# Altium project pcb-uwt-788.PrjPcb
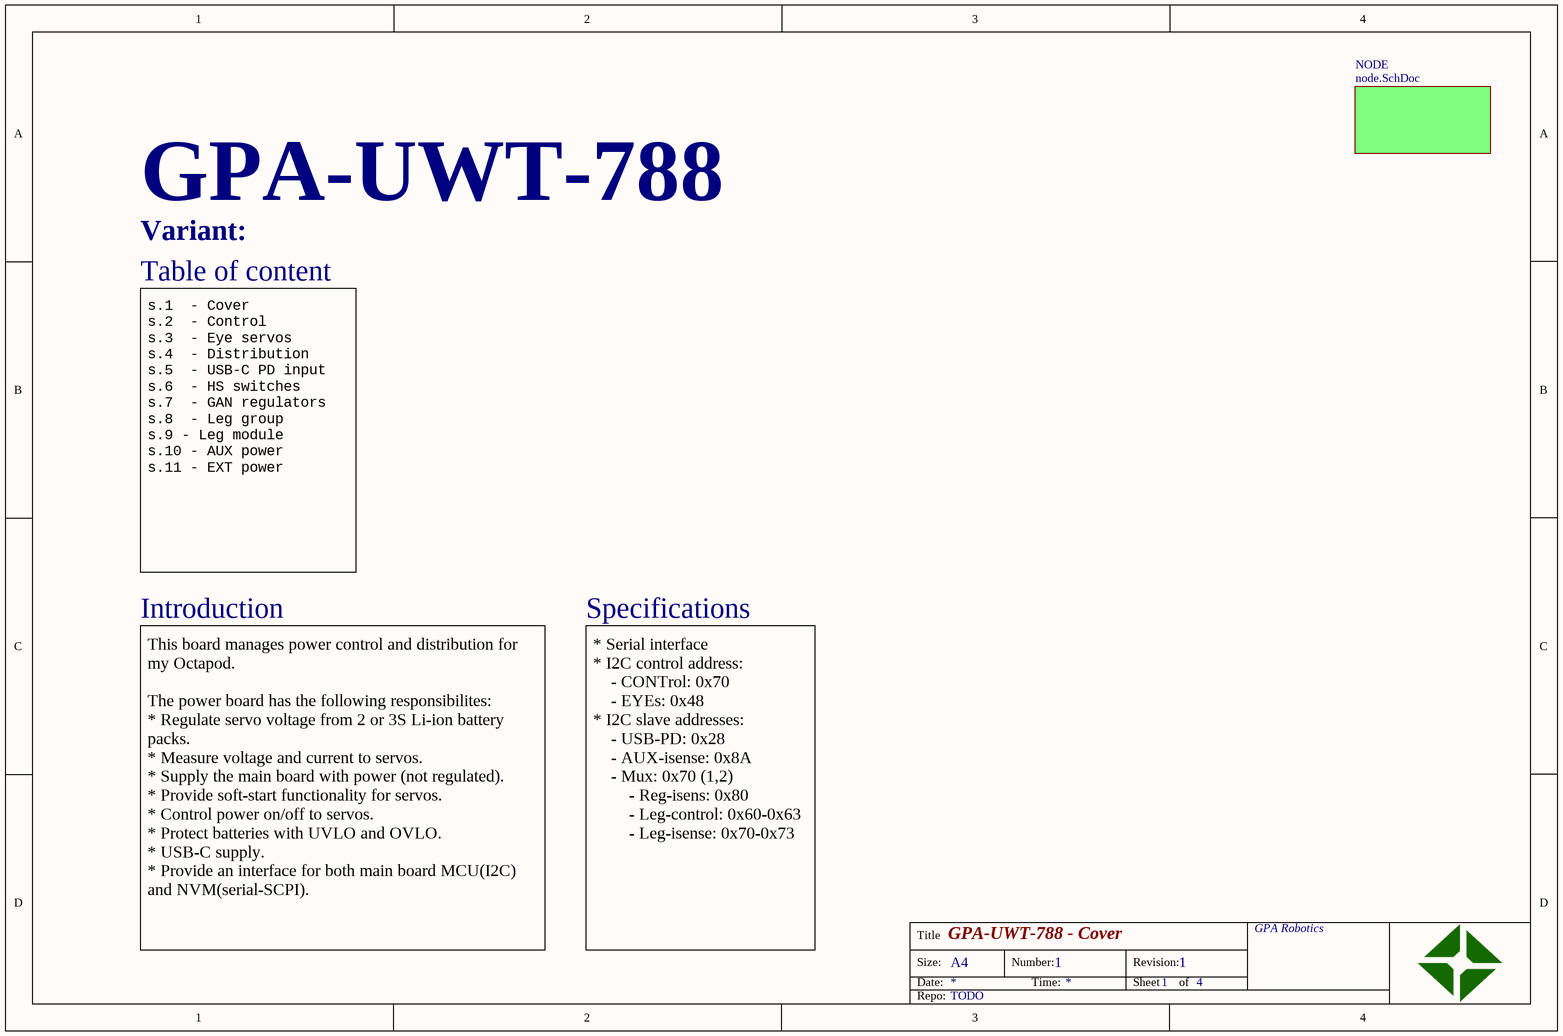
[diagram p0: cover.SchDoc]
project_author: Gustav Palmqvist; project_name: GPA-UWT-788; project_repo: TODO; project_revision: 1
4 sheets, 102 parts. Net scope: flat (ports and power ports of the same name join across sheets).
Board file: ioboard.PcbDoc
Sheets:
  cover.SchDoc
    NODE = node.SchDoc
      ETH_US = ethernet.SchDoc
      ETH_DS = ethernet.SchDoc
      POWER = powersupply.SchDoc

## Sheet cover.SchDoc: Cover
size A4; Organization: GPA Robotics; DocumentNumber: 1; SheetNumber: 1; SheetTotal: 4

### Sub-sheets
NODE = node.SchDoc: no entries

### Notes on the sheet
- Table of content
- s.1  - Cover
  s.2  - Control
  s.3  - Eye servos
  s.4  - Distribution
  s.5  - USB-C PD input
  s.6  - HS switches
  s.7  - GAN regulators
  s.8  - Leg group
  s.9 - Leg module
  s.10 - AUX power
  s.11 - EXT power
- Introduction
- Specifications
- This board manages power control and distribution for my Octapod.
  The power board has the following responsibilites:
  * Regulate servo voltage from 2 or 3S Li-ion battery packs.
  * Measure voltage and current to servos.
  * Supply the main board with power (not regulated).
  * Provide soft-start functionality for servos.
  * Control power on/off to servos.
  * Protect batteries with UVLO and OVLO.
  * USB-C supply.
  * Provide an interface for both main board MCU(I2C) and NVM(serial-SCPI).
- * Serial interface
  * I2C control address:
  - CONTrol: 0x70
  - EYEs: 0x48
  * I2C slave addresses:
  - USB-PD: 0x28
  - AUX-isense: 0x8A
  - Mux: 0x70 (1,2)
  - Reg-isens: 0x80
  - Leg-control: 0x60-0x63
  - Leg-isense: 0x70-0x73
- Variant:
- Title
- Size:
- Date:
- A4
- Number:
- Time:
- Revision:
- Sheet
- of
- Repo:

## Sheet node.SchDoc: Node
size A4; Organization: GPA Robotics; DocumentNumber: 2; Revision: REV 0; SheetNumber: 2; SheetTotal: 4
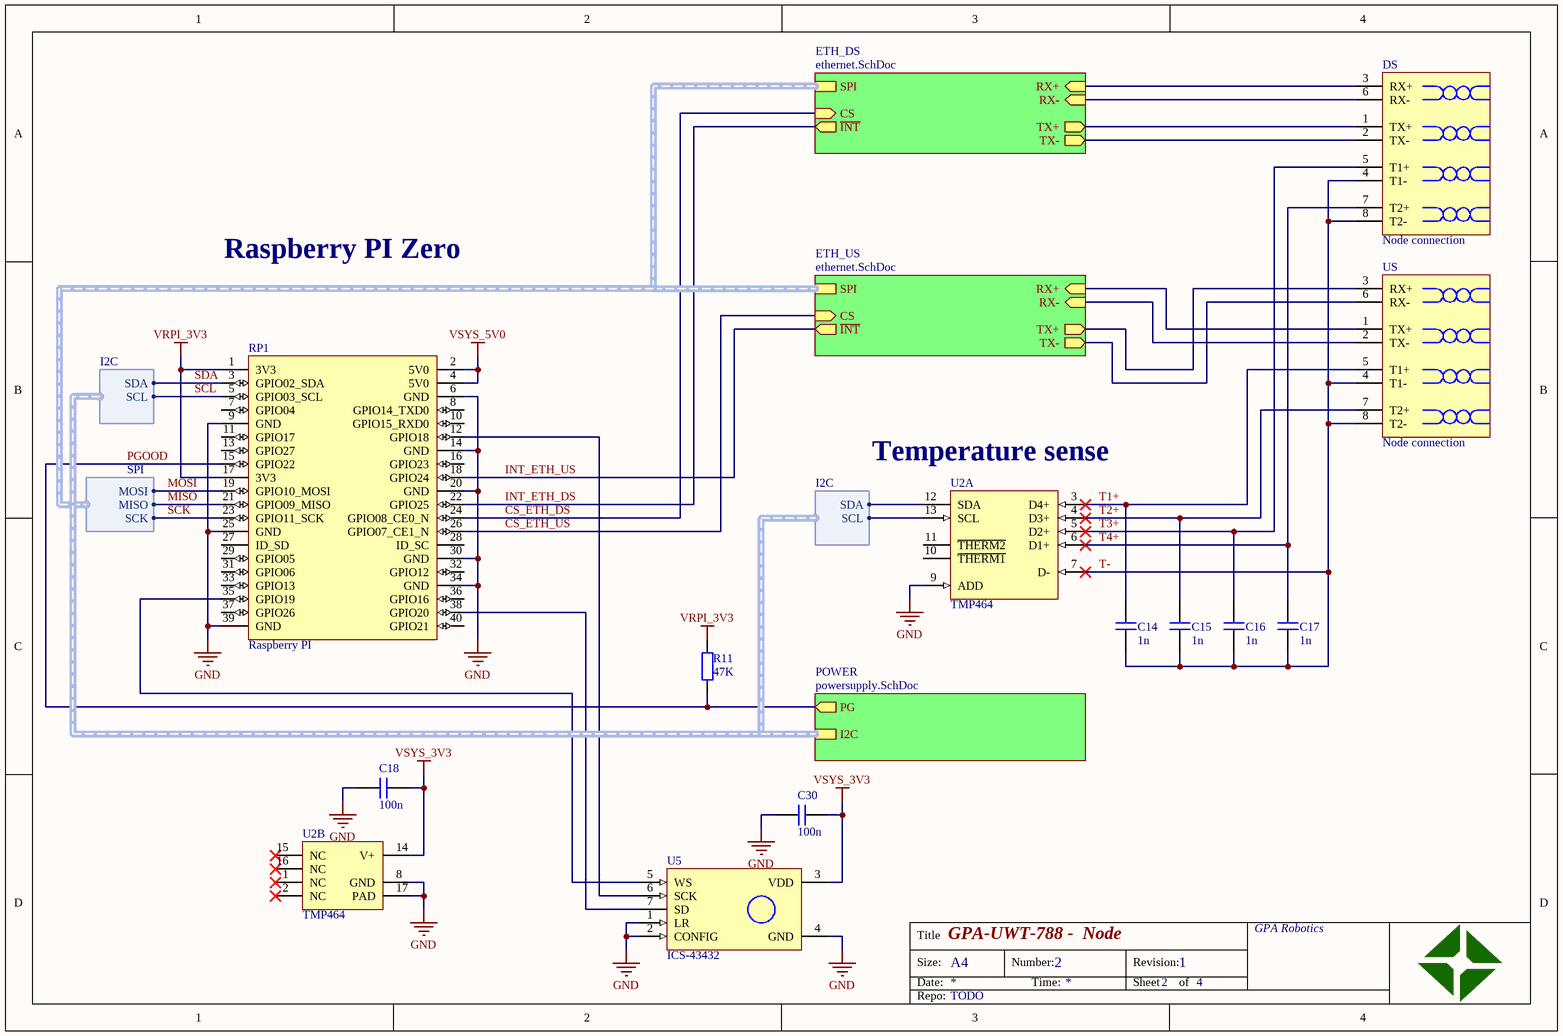
[diagram p1: node.SchDoc]

### Parts
C14  value 1n  [CAPC1005X06N]  (hidden comment: cap)
C15  value 1n  [CAPC1005X06N]  (hidden comment: cap)
C16  value 1n  [CAPC1005X06N]  (hidden comment: cap)
C17  value 1n  [CAPC1005X06N]  (hidden comment: cap)
C18  value 100n  [CAPC1005X06N]  (hidden comment: cap)
C30  value 100n  [CAPC1005X06N]  (hidden comment: cap)
DS  Node connection  [node_connection]  (no BOM)
R11  value 47K  [RESC1005X04N]  (hidden comment: res)
RP1  Raspberry PI  [raspi_male_con]
U2  TMP464  [QFN50P300X300X100_HS-17N_TMP464]  (parts A,B of 2)
U5  ICS-43432  [PSON65P300X110-6N]
US  Node connection  [node_connection]  (no BOM)

### Sub-sheets
ETH_DS = ethernet.SchDoc: RX+ (in), TX+ (out), RX- (in), TX- (out), SPI (harness SPI), CS (in), ~{INT} (out)
ETH_US = ethernet.SchDoc: RX+ (in), TX+ (out), RX- (in), TX- (out), SPI (harness SPI), CS (in), ~{INT} (out)
POWER = powersupply.SchDoc: PG (out), I2C (harness I2C)

### Harnesses
SPI: MOSI, MISO, SCK
I2C: SDA, SCL

### Nets
GND: C18.1 C30.1 RP1.6(GND) RP1.9(GND) RP1.14(GND) RP1.20(GND) RP1.25(GND) RP1.30(GND) RP1.34(GND) RP1.39(GND) U2.8(GND) U2.9(ADD) U2.17(PAD) U5.1(LR) U5.2(CONFIG) U5.4(GND)
VRPI_3V3: R11.2 RP1.1(3V3) RP1.17(3V3)
VSYS_3V3: C18.2 C30.2 U2.14(V+) U5.3(VDD)
VSYS_5V0: RP1.2(5V0) RP1.4(5V0)
CS_ETH_DS: RP1.24(GPIO08_CE0_N) ; sheet ETH_DS/CS
CS_ETH_US: RP1.26(GPIO07_CE1_N) ; sheet ETH_US/CS
INT_ETH_DS: RP1.22(GPIO25) ; sheet ETH_DS/~{INT}
INT_ETH_US: RP1.18(GPIO24) ; sheet ETH_US/~{INT}
MISO: RP1.21(GPIO09_MISO) ; sheet ETH_US/SPI.MISO
MOSI: RP1.19(GPIO10_MOSI) ; sheet ETH_US/SPI.MOSI
PGOOD: R11.1 RP1.15(GPIO22) ; sheet POWER/PG
SCK: RP1.23(GPIO11_SCK) ; sheet ETH_US/SPI.SCK
SCL: RP1.5(GPIO03_SCL) U2.13(SCL) ; sheet POWER/I2C.SCL
SDA: RP1.3(GPIO02_SDA) U2.12(SDA) ; sheet POWER/I2C.SDA
T1+: C14.2 U2.3(D4+) US.5(T1+)
T2+: C15.2 U2.4(D3+) US.7(T2+)
T3+: C16.2 DS.5(T1+) U2.5(D2+)
T4+: C17.2 DS.7(T2+) U2.6(D1+)
T-: C14.1 C15.1 C16.1 C17.1 DS.4(T1-) DS.8(T2-) U2.7(D-) US.4(T1-) US.8(T2-)
NetDS_1: DS.1(TX+) ; sheet ETH_DS/TX+
NetDS_2: DS.2(TX-) ; sheet ETH_DS/TX-
NetDS_3: DS.3(RX+) ; sheet ETH_DS/RX+
NetDS_6: DS.6(RX-) ; sheet ETH_DS/RX-
NetRP1_12: RP1.12(GPIO18) U5.6(SCK)
NetRP1_35: RP1.35(GPIO19) U5.5(WS)
NetRP1_38: RP1.38(GPIO20) U5.7(SD)
NetUS_1: US.1(TX+) ; sheet ETH_US/RX+
NetUS_2: US.2(TX-) ; sheet ETH_US/RX-
NetUS_3: US.3(RX+) ; sheet ETH_US/TX+
NetUS_6: US.6(RX-) ; sheet ETH_US/TX-

Not connected (* = marked no-connect by the designer): RP1 7(GPIO04) 8(GPIO14_TXD0) 10(GPIO15_RXD0) 11(GPIO17) 13(GPIO27) 16(GPIO23) 27(ID_SD) 28(ID_SC) 29(GPIO05) 31(GPIO06) 32(GPIO12) 33(GPIO13) 36(GPIO16) 37(GPIO26) 40(GPIO21); U2 1(NC)* 2(NC)* 10(~{THERM1}) 11(~{THERM2}) 15(NC)* 16(NC)*

### Buses and harness runs
harness sheet ETH_DS/SPI = sheet ETH_US/SPI

### Notes on the sheet
- Raspberry PI Zero
- (near U2) Temperature sense
- Title
- Size:
- Date:
- A4
- Number:
- Time:
- Revision:
- Sheet
- of
- Repo:

### Library data of the parts
C14-C18 C30 = cap: Capacitor; voltage: *; type: *; #digikey: *; #mouser: *
DS US = node_connection
R11 = res: Resistor; power: *; voltage: *; #digikey: *; #mouser: *
RP1 = raspberry_2x20_con: Raspberry PI 2x20 connector
U2 = tmp464rgt: High-Accuracy 5-Channel (4-Remote and 1-Local) Temperature Sensor; ComponentLink1Description: Datasheet; ComponentLink1URL: https://www.ti.com/lit/ds/symlink/tmp464.pdf; Supplier 1: Digi-Key; Supplier Part Number 1: 296-46946-1-ND; Supplier 2: Digi-Key; Supplier Part Number 2: 296-50713-1-ND

## Sheet ethernet.SchDoc: Ethernet
size A4; Organization: GPA Robotics; DocumentNumber: 3; Revision: REV 0; SheetNumber: 3; SheetTotal: 4
Used 2 times, as channels NODE/ETH_US, NODE/ETH_DS. Parts and nets are listed once, with the designators drawn on the sheet.
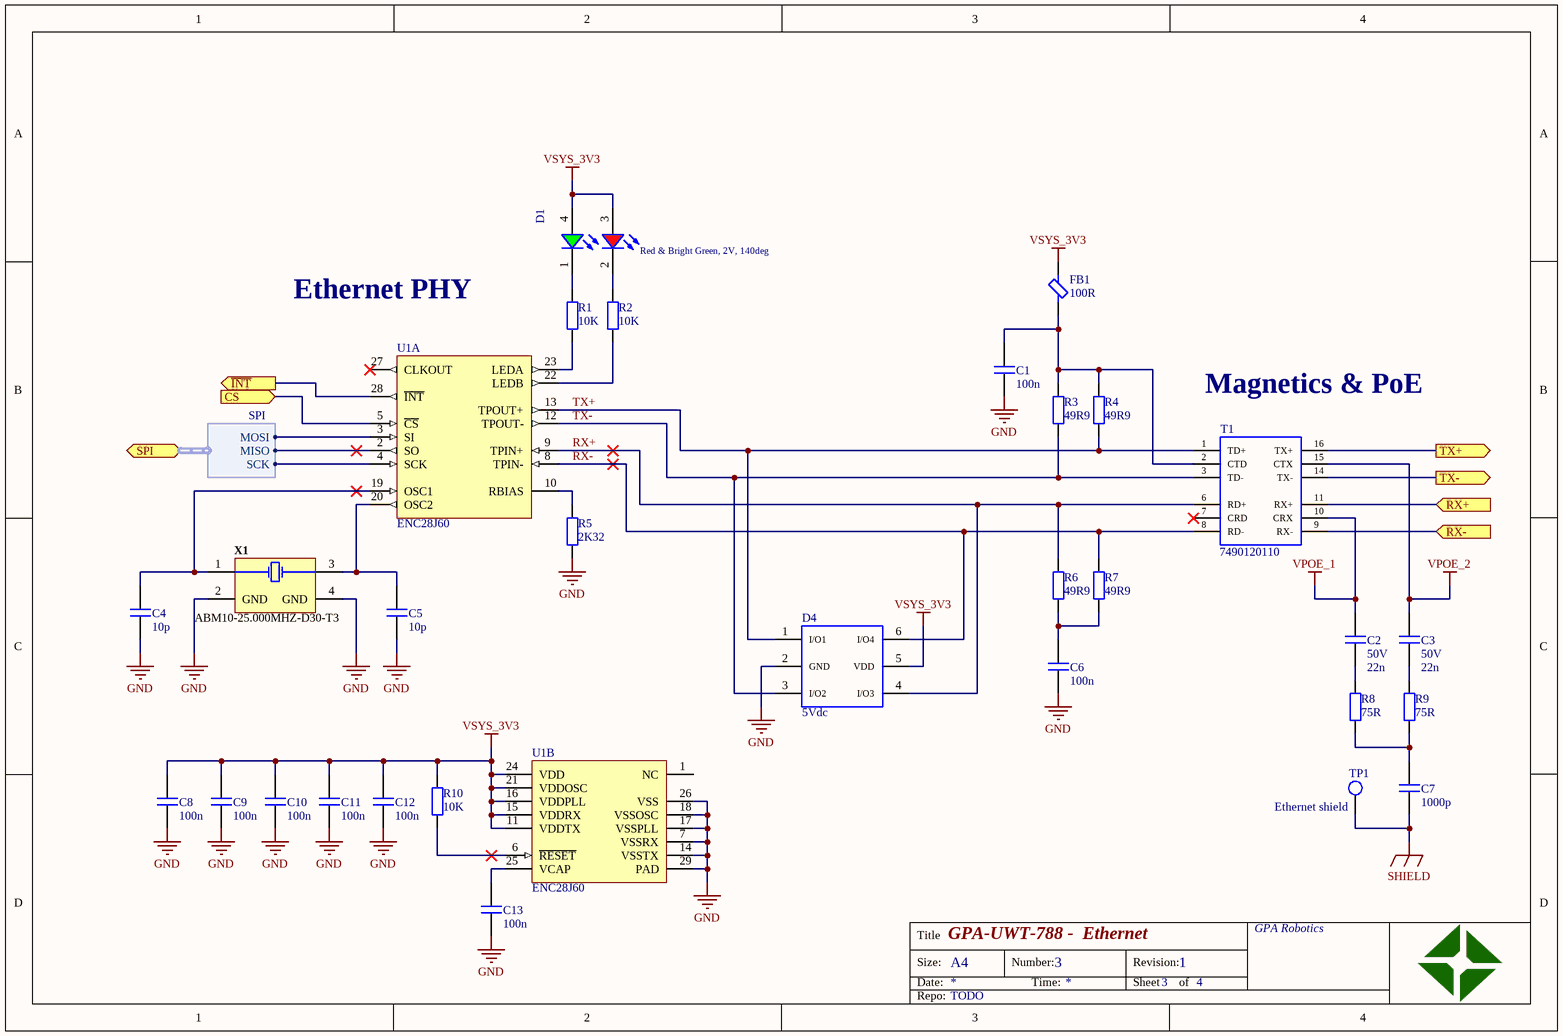
[diagram p2: ethernet.SchDoc]

### Parts
C1  value 100n  [CAPC1005X06N]  (hidden comment: cap)
C2  value 22n  voltage: 50V  [CAPC1005X06N]  (hidden comment: cap)
C3  value 22n  voltage: 50V  [CAPC1005X06N]  (hidden comment: cap)
C4  value 10p  [CAPC1005X06N]  (hidden comment: cap)
C5  value 10p  [CAPC1005X06N]  (hidden comment: cap)
C6  value 100n  [CAPC1005X06N]  (hidden comment: cap)
C7  value 1000p  [CAPC3216X14N]  (hidden comment: cap)
C8  value 100n  [CAPC1005X06N]  (hidden comment: cap)
C9  value 100n  [CAPC1005X06N]  (hidden comment: cap)
C10  value 100n  [CAPC1005X06N]  (hidden comment: cap)
C11  value 100n  [CAPC1005X06N]  (hidden comment: cap)
C12  value 100n  [CAPC1005X06N]  (hidden comment: cap)
C13  value 100n  [CAPC1005X06N]  (hidden comment: cap)
D1  Red & Bright Green, 2V, 140deg  [WL-SBCC_0603]
D4  5Vdc  [WE-TVS_SOT23-6L]
FB1  value 100R  [INDC1005X06N]  (hidden comment: ferrite)
R1  value 10K  [RESC1005X04N]  (hidden comment: res)
R2  value 10K  [RESC1005X04N]  (hidden comment: res)
R3  value 49R9  [RESC1005X04N]  (hidden comment: res)
R4  value 49R9  [RESC1005X04N]  (hidden comment: res)
R5  value 2K32  [RESC1005X04N]  (hidden comment: res)
R6  value 49R9  [RESC1005X04N]  (hidden comment: res)
R7  value 49R9  [RESC1005X04N]  (hidden comment: res)
R8  value 75R  [RESC1005X04N]  (hidden comment: res)
R9  value 75R  [RESC1005X04N]  (hidden comment: res)
R10  value 10K  [RESC1005X04N]  (hidden comment: res)
T1  7490120110  [7490120110]
TP1  Ethernet shield  [testpoint_tht_09mm]  (no BOM)
U1  ENC28J60  [QFN65P600X600X100_HS-29N-ENC28J60]  (parts A,B of 2)
X1  ABM10-25.000MHZ-D30-T3  [ABRA-ABM10_V]

### Ports
CS (in), RX+ (in), RX- (in), SPI (bidir, harness SPI), TX+ (out), TX- (out), ~{INT} (out)

### Harnesses
SPI: MOSI, MISO, SCK

### Nets
GND: C1.1 C4.1 C5.1 C6.1 C8.1 C9.1 C10.1 C11.1 C12.1 C13.1 D4.2(GND) R5.1 U1.7(VSSRX) U1.14(VSSTX) U1.17(VSSPLL) U1.18(VSSOSC) U1.26(VSS) U1.29(PAD) X1.2(GND) X1.4(GND)
SHIELD: C7.1 TP1.1
VPOE_1: C2.2 T1.10(CRX)
VPOE_2: C3.2 T1.15(CTX)
VSYS_3V3: C8.2 C9.2 C10.2 C11.2 C12.2 D1.3(A) D1.4(A) D4.5(VDD) FB1.2 R10.2 U1.11(VDDTX) U1.15(VDDRX) U1.16(VDDPLL) U1.21(VDDOSC) U1.24(VDD)
~{INT}: U1.28(~{INT}) ; port ~{INT}
CS: U1.5(~{CS}) ; port CS
RX+: D4.4(I/O3) R6.2 T1.6(RD+) U1.9(TPIN+)
RX+: T1.11(RX+) ; port RX+  [a separate net that carries the same name]
RX-: D4.6(I/O4) R7.2 T1.8(RD-) U1.8(TPIN-)
RX-: T1.9(RX-) ; port RX-  [a separate net that carries the same name]
TX+: D4.1(I/O1) R4.1 T1.1(TD+) U1.13(TPOUT+)
TX+: T1.16(TX+) ; port TX+  [a separate net that carries the same name]
TX-: D4.3(I/O2) R3.1 T1.3(TD-) U1.12(TPOUT-)
TX-: T1.14(TX-) ; port TX-  [a separate net that carries the same name]
NetC1_2: C1.2 FB1.1 R3.2 R4.2 T1.2(CTD)
NetC2_1: C2.1 R8.2
NetC3_1: C3.1 R9.2
NetC4_2: C4.2 U1.19(OSC1) X1.1(X1)
NetC5_2: C5.2 U1.20(OSC2) X1.3(X2)
NetC6_2: C6.2 R6.1 R7.1
NetC7_2: C7.2 R8.1 R9.1
NetC13_2: C13.2 U1.25(VCAP)
NetD1_1: D1.1(K) R1.2
NetD1_2: D1.2(K) R2.2
NetR1_1: R1.1 U1.23(LEDA)
NetR2_1: R2.1 U1.22(LEDB)
NetR5_2: R5.2 U1.10(RBIAS)
NetR10_1: R10.1 U1.6(~{RESET})
NetU1_2: U1.2(SO) ; port SPI.MISO
NetU1_3: U1.3(SI) ; port SPI.MOSI
NetU1_4: U1.4(SCK) ; port SPI.SCK

Not connected (* = marked no-connect by the designer): T1 7(CRD)*; U1 1(NC) 27(CLKOUT)*

### Channels
NODE/ETH_US: designators end in _ETH_US; ports CS=NetU1_ETH_DS_5 RX+=NetT1_ETH_DS_11 RX-=NetT1_ETH_DS_9 TX+=NetT1_ETH_DS_16 TX-=NetT1_ETH_DS_14 ~{INT}=NetU1_ETH_DS_28
NODE/ETH_DS: designators end in _ETH_DS; ports CS=NetU1_ETH_DS_5 RX+=NetT1_ETH_DS_11 RX-=NetT1_ETH_DS_9 TX+=NetT1_ETH_DS_16 TX-=NetT1_ETH_DS_14 ~{INT}=NetU1_ETH_DS_28

### Notes on the sheet
- Ethernet PHY
- (near T1) Magnetics & PoE
- Title
- Size:
- Date:
- A4
- Number:
- Time:
- Revision:
- Sheet
- of
- Repo:

### Library data of the parts
C1-C6 C8-C13 = cap: Capacitor; type: *; #digikey: *; #mouser: *
  C1 C4-C6 C8-C13: voltage: *
C7 = cap: Capacitor; voltage: 2kV; type: *; #digikey: *; #mouser: *; Supplier 1: Digi-Key; Supplier Part Number 1: 311-4501-1-ND
D1 = 150060RV75240: WL-SBCC SMT Bi-color Chip LED Compact, size 0603, Red & Bright Green, 2V, 140deg; Peak Wavelength typ.: 630nm@Red, 572nm@Bright Green; Dominant Wavelength typ.: 625nm@Red, 570nm@Bright Green; Luminous Intensity typ.: 230mcd@Red, 90mcd@Bright Green; Chip Technology: AlInGaP; ComponentLink1Description: Manufacturer; ComponentLink1URL: http://www.we-online.de; ComponentLink2Description: Datasheet; ComponentLink2URL: https://katalog.we-online.de/led/datasheet/150060RV75240.pdf; Part Number: 150060RV75240; Published Date: June 2019; Publisher: Wurth Elektronik; Size: 0603; Forward Voltage typ.: 2V; Viewing Angle typ.: 140deg; Operating Temperature: -40 to +85degC; Emitting Color: Red & Bright Green; Mounting Technology: SMT; Packaging: Tape and Reel
D4 = 824015: WE-TVS TVS Diode - High Speed Series, SOT23-6L, 4+1Channel, 5Vdc; Manufacturer: Wurth Elektronik; Reverse Breakdown Voltage min.: 6.1V; Channel: 4+1; Channel Input Capacitance: 2pF; Reverse Peak Pulse Current: 12A; Reverse Channel Leakage Current: 2uA; DC Operating Voltage: 5V; ComponentLink1Description: Manufacturer; ComponentLink1URL: http://www.we-online.de; ComponentLink2Description: Datasheet; ComponentLink2URL: https://www.we-online.com/catalog/datasheet/824015.pdf; Manufacturer Part Number: 824015; Published Date: April 2020; Size: SOT23-6L; Operating Temperature: -40 to +125degC; Mounting Technology: SMT; Packaging: Tape and Reel
FB1 = ferrite: Inductor; #digikey: *; #mouser: *
R1-R10 = res: Resistor; power: *; voltage: *; #digikey: *; #mouser: *
T1 = 7490120110: WE-LAN LAN Transformer, SMT, 10/100 Base-T, 1 port; Manufacturer: Wurth Elektronik; PoE Current: 720mA; Turns Ratio: 1:1; HPLE: No; Number of Ports: 1; Inductance: 120uH; Insulation Test Voltage: 1500Vrms; ComponentLink1Description: Manufacturer; ComponentLink1URL: http://www.we-online.de; ComponentLink2Description: Datasheet; ComponentLink2URL: https://www.we-online.com/catalog/datasheet/7490120110.pdf; Operating Temperature: -40 to +85degC; Published Date: March 2020; Manufacturer Part Number: 7490120110; Packaging: Tape and Reel; Data Rate: 10/100 Base-T; Mounting Technology: SMT
TP1 = testpoint: Test point; testpoint: .Comment; #digikey: *; #mouser: *
U1 = enc28j60-iml: Stand-Alone Ethernet Controller with SPI Interface; ComponentLink1Description: Datasheet; ComponentLink1URL: http://ww1.microchip.com/downloads/en/DeviceDoc/39662e.pdf
X1 = CMP-2000-05727-1: Ceramic SMD Ultra Miniature Quartz Crystal, 25 MHz, 100 Ohm, 10 pF, -40 to 85 degC, 4-Pin SMD, RoHS, Tape and Reel; Manufacturer: ABRACON; Case Width: 2mm; Case Length: 2.5mm; Frequency: 25MHz; ESR: 100Ohms; Load Capacitance: 10pF; Case Height: 0.5mm; Tolerance: 20PPM; Frequency Stability: 30PPM; Manufacturer URL: http://www.abracon.com/; Datasheet URL: https://datasheet.ciiva.com/4946/abm10-31166-4946144.pdf; Type: UltraMiniatureQuartzCrystal; Series: ABM10; Mounting Style: SMD/SMT; Operating Temperature Range: -40Cto+85C; Mounting Technology: SurfaceMount; Factory Pack Quantity: 3000; Datasheet Version: 01/2013; Packaging: Reel; Brand: ABRACON; Package Description: 4-Pin Surface Mount Device, Body 2 x 2.5 mm, Pitch 1.65 mm; Termination Style: SMD/SMT; Product Category: Crystals; Package / Case: 2.5mmx2mmx0.5mm; Dimensions: 2mmWx2.5mmLx0.5mmH; RoHS: Details; Package Reference: ABM10

## Sheet powersupply.SchDoc: Power supply
size A4; Organization: GPA Robotics; DocumentNumber: 4; Revision: REV 0; SheetNumber: 4; SheetTotal: 4
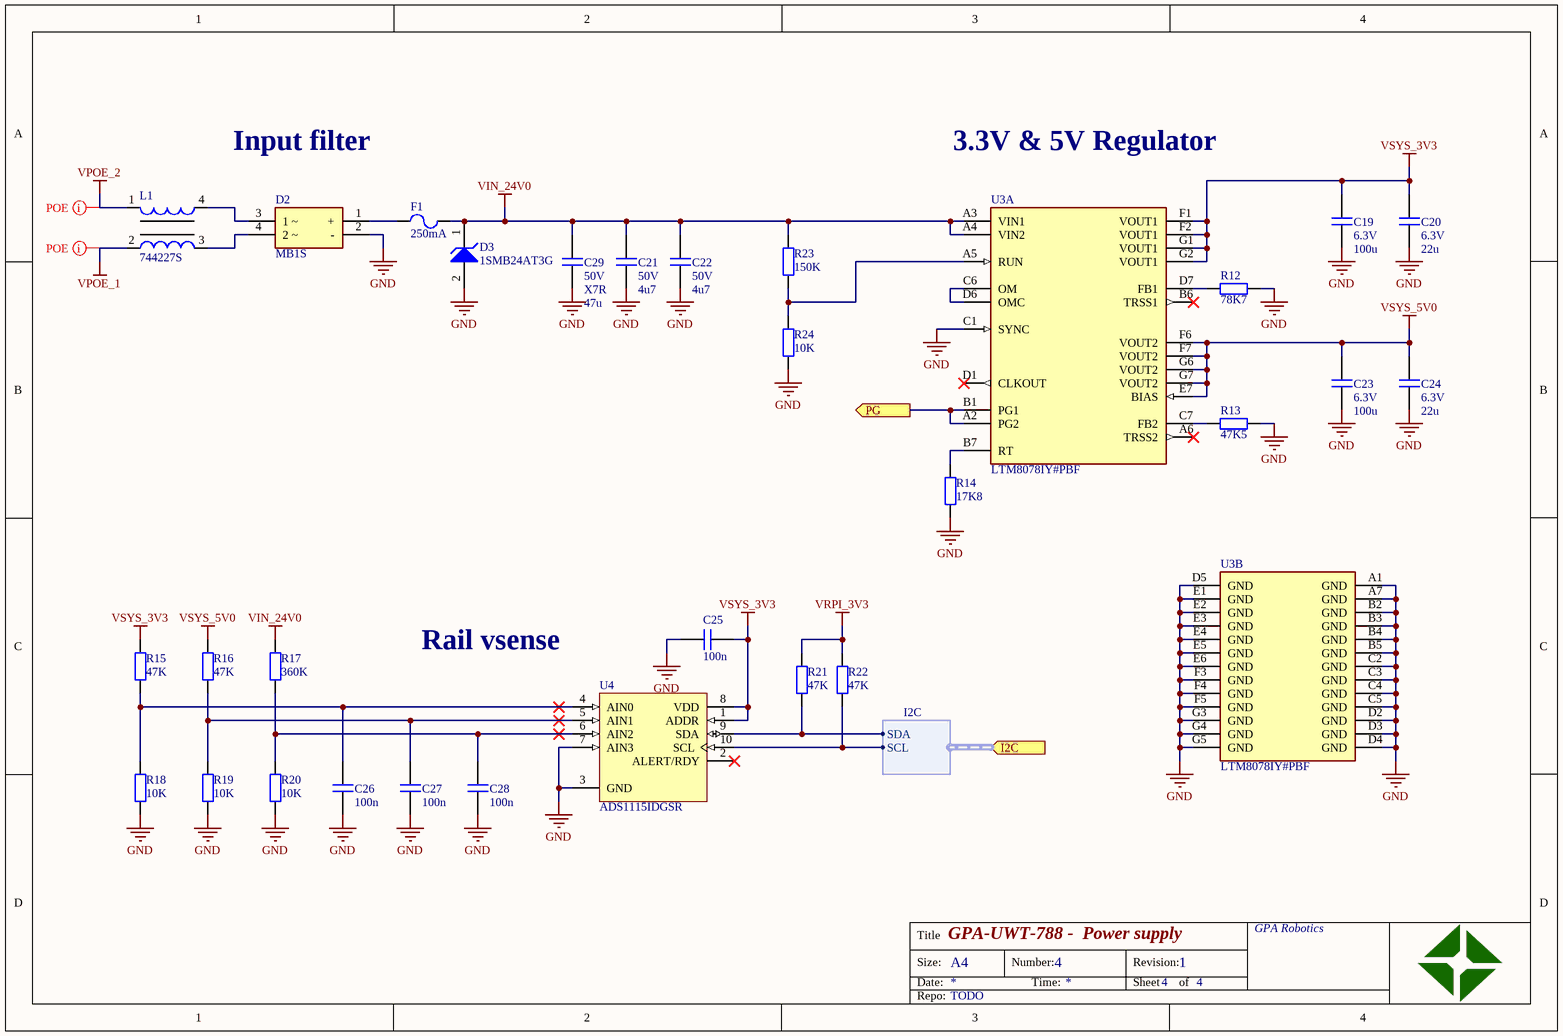
[diagram p3: powersupply.SchDoc]

### Parts
C19  value 100u  voltage: 6.3V  [CAPC2012X11N]  (hidden comment: cap)
C20  value 22u  voltage: 6.3V  [CAPC2012X11N]  (hidden comment: cap)
C21  value 4u7  voltage: 50V  [CAPC2012X11N]  (hidden comment: cap)
C22  value 4u7  voltage: 50V  [CAPC2012X11N]  (hidden comment: cap)
C23  value 100u  voltage: 6.3V  [CAPC2012X11N]  (hidden comment: cap)
C24  value 22u  voltage: 6.3V  [CAPC2012X11N]  (hidden comment: cap)
C25  value 100n  [CAPC1005X06N]  (hidden comment: cap)
C26  value 100n  [CAPC1005X06N]  (hidden comment: cap)
C27  value 100n  [CAPC1005X06N]  (hidden comment: cap)
C28  value 100n  [CAPC1005X06N]  (hidden comment: cap)
C29  value 47u  voltage: 50V  type: X7R  [CAPC3225X14N]  (hidden comment: cap)
D2  MB1S  [FP-751EP-MFG]
D3  1SMB24AT3G  [ONSC-SMB-2-403A-03_H_V]
F1  value 250mA  [RESC1608X06N]  (hidden comment: fuse)
L1  744227S  [WE-SL2]
R12  value 78K7  [RESC1005X04N]  (hidden comment: res)
R13  value 47K5  [RESC1005X04N]  (hidden comment: res)
R14  value 17K8  [RESC1005X04N]  (hidden comment: res)
R15  value 47K  [RESC1005X04N]  (hidden comment: res)
R16  value 47K  [RESC1005X04N]  (hidden comment: res)
R17  value 360K  [RESC1005X04N]  (hidden comment: res)
R18  value 10K  [RESC1005X04N]  (hidden comment: res)
R19  value 10K  [RESC1005X04N]  (hidden comment: res)
R20  value 10K  [RESC1005X04N]  (hidden comment: res)
R21  value 47K  [RESC1005X04N]  (hidden comment: res)
R22  value 47K  [RESC1005X04N]  (hidden comment: res)
R23  value 150K  [RESC1005X04N]  (hidden comment: res)
R24  value 10K  [RESC1005X04N]  (hidden comment: res)
U3  LTM8078IY#PBF  [FP-BGA-49-05-08-1518-MFG]  (parts A,B of 2)
U4  ADS1115IDGSR  [TI-DGS10_N]

### Ports
I2C (in, harness I2C), PG (out)

### Harnesses
I2C: SDA, SCL

### Nets
GND: C19.1 C20.1 C21.1 C22.1 C23.1 C24.1 C25.1 C26.1 C27.1 C28.1 C29.1 D2.2(-) D3.2(A) R12.2 R13.2 R14.1 R18.1 R19.1 R20.1 R24.1 U3.A1(GND) U3.A7(GND) U3.B2(GND) U3.B3(GND) U3.B4(GND) U3.B5(GND) U3.C1(SYNC) U3.C2(GND) U3.C3(GND) U3.C4(GND) U3.C5(GND) U3.D2(GND) U3.D3(GND) U3.D4(GND) U3.D5(GND) U3.E1(GND) U3.E2(GND) U3.E3(GND) U3.E4(GND) U3.E5(GND) U3.E6(GND) U3.F3(GND) U3.F4(GND) U3.F5(GND) U3.G3(GND) U3.G4(GND) U3.G5(GND) U4.3(GND) U4.7(AIN3)
VIN_24V0: C21.2 C22.2 C29.2 D3.1(K) F1.2 R17.2 R23.2 U3.A3(VIN1) U3.A4(VIN2)
VPOE_1: L1.2
VPOE_2: L1.1
VRPI_3V3: R21.2 R22.2
VSYS_3V3: C19.2 C20.2 C25.2 R15.2 U3.F1(VOUT1) U3.F2(VOUT1) U3.G1(VOUT1) U3.G2(VOUT1) U4.1(ADDR) U4.8(VDD)
VSYS_5V0: C23.2 C24.2 R16.2 U3.E7(BIAS) U3.F6(VOUT2) U3.F7(VOUT2) U3.G6(VOUT2) U3.G7(VOUT2)
NetC26_2: C26.2 R15.1 R18.2 U4.4(AIN0)
NetC27_2: C27.2 R16.1 R19.2 U4.5(AIN1)
NetC28_2: C28.2 R17.1 R20.2 U4.6(AIN2)
NetD2_1: D2.1(+) F1.1
NetD2_3: D2.3(1_~) L1.4
NetD2_4: D2.4(2_~) L1.3
NetR12_1: R12.1 U3.D7(FB1)
NetR13_1: R13.1 U3.C7(FB2)
NetR14_2: R14.2 U3.B7(RT)
NetR21_1: R21.1 U4.9(SDA) ; port I2C.SDA
NetR22_1: R22.1 U4.10(SCL) ; port I2C.SCL
NetR23_1: R23.1 R24.2 U3.A5(RUN)
NetU3_A2: U3.A2(PG2) U3.B1(PG1) ; port PG
NetU3_C6: U3.C6(OM) U3.D6(OMC)

Not connected (* = marked no-connect by the designer): U3 A6(TRSS2)* B6(TRSS1)* D1(CLKOUT)*; U4 2(ALERT/RDY)*

### Layout directives
net class POE: VPOE_1, VPOE_2

### Notes on the sheet
- Input filter
- 3.3V & 5V Regulator
- Rail vsense
- Title
- Size:
- Date:
- A4
- Number:
- Time:
- Revision:
- Sheet
- of
- Repo:

### Library data of the parts
C19-C29 = cap: Capacitor; #digikey: *; #mouser: *
  C19-C24: type: *
  C25-C28: voltage: *; type: *
D2 = CMP-07163-000028-1: BRIDGE RECT 1P 100V 500MA 4SOIC; Manufacturer: ON Semiconductor; Forward Current: 0.5A; Value: 13pF; Max Surge Forward Current: 35A; Max Junction Temp: +150°C; Peak Reverse Current: 5uA; Standoff Height: 0.05mm; Temperature: -55°C to +150°C; Ipc Land Pattern Name: SOIC254P670X265-4; Digikey Description: BRIDGE RECT 1P 100V 500MA 4SOIC; Device Class L3: Rectifier Diodes; Max Repetitive Reverse Voltage: 100V; Device Class L2: Diodes; Automotive: No; RoHS: TRUE; ComponentLink2Description: Datasheet; Manufacturer Part Number: MB1S; Mouser Description: Diode Rectifier Bridge Single 100V 0.5A 4-Pin SOIC N T/R; Temperature Range Low: -55°C; Category: Diode; ComponentLink2URL: https://www.onsemi.com/pub/Collateral/MB8S-D.PDF; Reverse Voltage: 100V; Package: 751EP; Temperature Range High: +150°C; Octopart: https://octopart.com/mb1s-on+semiconductor-84329760; Footprint Url: https://www.onsemi.com/pub/Collateral/751EP.PDF; Capacitance: 13pF; Height: 2.9mm; Lead Free: Yes; Device Class L1: Discrete Semiconductors
D3 = CMP-1061-00363-1: 600 W Peak Power Zener Transient Voltage Suppressor, Unidirectional, 2-Pin SMB, Pb-Free, Tape and Reel; Manufacturer: On Semiconductor; IR Max (uA): 5; PPK Max (W): 600; V(BR) Typ (V): 28.1; Packing: Tape and Reel; ComponentLink2URL: http://www.onsemi.com/pub_link/Collateral/1SMB5.0AT3-D.PDF; RoHS: Pb-Free; ComponentLink1URL: http://www.onsemi.com/; PackageVersion: Rev. H, 05/2011; ComponentLink1Description: Manufacturer URL; ComponentLink3Description: Package Specification; PartNumber: 1SMB24AT3G; PackageDescription: 2-Pin Small Molded Package, J-Bend Lead, Body 4.33 x 3.625 mm; Mounting Technology: Surface Mount; ComponentLink2Description: Datasheet; PackageReference: SMB-2-403A-03_H; ComponentLink3URL: http://www.onsemi.com/pub_link/Collateral/1SMB5913BT3-D.PDF; Direction: Unidirectional; DatasheetVersion: Rev. 13
F1 = fuse: Resistor; voltage: *; #digikey: *; #mouser: *
L1 = CMP-0222-00062-1: SMD Common Mode Line Filter WE-SL2, L = 51.0 µH; Inductance: 51.0 ÂµH; ComponentLink2Description: Datasheet; PackageDescription: SMD Inductor, 4-Leads, Body 6.3 x 9.5 mm; DatasheetVersion: ver 7, Oct-2004; ComponentLink2URL: http://www.we-online.de/katalog/media/pdf/744227S.pdf; PackageReference: WE-SL2; ComponentLink1Description: Manufacturer Link; ComponentLink1URL: http://www.we-online.com; PackageVersion: 2010
R12-R24 = res: Resistor; power: *; voltage: *; #digikey: *; #mouser: *
U3 = CMP-09139-000029-1: DUAL 40VIN, 3A SILENT SWITCR UMO
U4 = CMP-0003-00385-2: 16-Bit ADC with Integrated Multiplexer, PGA, Comparator, Oscillator, and Reference, -40 to 125 degC, 10-pin SOP (DGS10), Green (RoHS & no Sb/Br); Manufacturer: Texas Instruments; Digital Supply(Min)(V): 2; # Input Channels: 4; Resolution(Bits): 16; SubFamily: Precision ADC (<=10MSPS); Sample Rate (max)(SPS): 860; Analog Voltage AV/DD(Max)(V): 5.5; INL(Max)(+/-LSB): 1; Interface: Serial I2C; Architecture: Delta-Sigma; PackageVersion: 4073272/C, 02/2004; Mounting Technology: Surface Mount; ComponentLink1URL: http://www.ti.com/; Eco-Plan: Green (RoHS & no Sb/Br); Analog Voltage AV/DD(Min)(V): 2; ComponentLink3URL: http://www.ti.com/lit/ml/mpds035b/mpds035b.pdf; PartNumber: ADS1115IDGSR; ComponentLink3Description: Package Specification; DatasheetVersion: SBAS444B; ComponentLink1Description: Manufacturer URL; Code_JEDEC: MO-153; Digital Supply(Max)(V): 5.5; ComponentLink2Description: Datasheet; ComponentLink2URL: http://www.ti.com/general/docs/lit/getliterature.tsp?genericPartNumber=ADS1115&fileType=pdf; PackageDescription: 10-Pin Plastic Small Outline, Body 3 x 3 mm, Pitch 0.5 mm; PackageReference: DGS10

## Nets that join several sheets
GND: node (16 pins), NODE/ETH_US (20 pins), NODE/ETH_DS (20 pins), powersupply (49 pins)
SHIELD: NODE/ETH_US (C7_ETH_US.1 TP1_ETH_US.1), NODE/ETH_DS (C7_ETH_DS.1 TP1_ETH_DS.1)
VPOE_1: NODE/ETH_US (C2_ETH_US.2 T1_ETH_US.10), NODE/ETH_DS (C2_ETH_DS.2 T1_ETH_DS.10), powersupply (L1.2)
VPOE_2: NODE/ETH_US (C3_ETH_US.2 T1_ETH_US.15), NODE/ETH_DS (C3_ETH_DS.2 T1_ETH_DS.15), powersupply (L1.1)
VRPI_3V3: node (R11.2 RP1.1 RP1.17), powersupply (R21.2 R22.2)
VSYS_3V3: node (C18.2 C30.2 U2.14 U5.3), NODE/ETH_US (15 pins), NODE/ETH_DS (15 pins), powersupply (10 pins)
VSYS_5V0: node (RP1.2 RP1.4), powersupply (8 pins)
NetT1_ETH_DS_9: NODE/ETH_US (T1_ETH_US.9), NODE/ETH_DS (T1_ETH_DS.9)
NetT1_ETH_DS_11: NODE/ETH_US (T1_ETH_US.11), NODE/ETH_DS (T1_ETH_DS.11)
NetT1_ETH_DS_14: NODE/ETH_US (T1_ETH_US.14), NODE/ETH_DS (T1_ETH_DS.14)
NetT1_ETH_DS_16: NODE/ETH_US (T1_ETH_US.16), NODE/ETH_DS (T1_ETH_DS.16)
NetU1_ETH_DS_2: NODE/ETH_US (U1_ETH_US.2), NODE/ETH_DS (U1_ETH_DS.2)
NetU1_ETH_DS_3: NODE/ETH_US (U1_ETH_US.3), NODE/ETH_DS (U1_ETH_DS.3)
NetU1_ETH_DS_4: NODE/ETH_US (U1_ETH_US.4), NODE/ETH_DS (U1_ETH_DS.4)
NetU1_ETH_DS_5: NODE/ETH_US (U1_ETH_US.5), NODE/ETH_DS (U1_ETH_DS.5)
NetU1_ETH_DS_28: NODE/ETH_US (U1_ETH_US.28), NODE/ETH_DS (U1_ETH_DS.28)